# EAGLE design STorM32 NT BGC v332m sz2u (EAGLE 7.5.0)
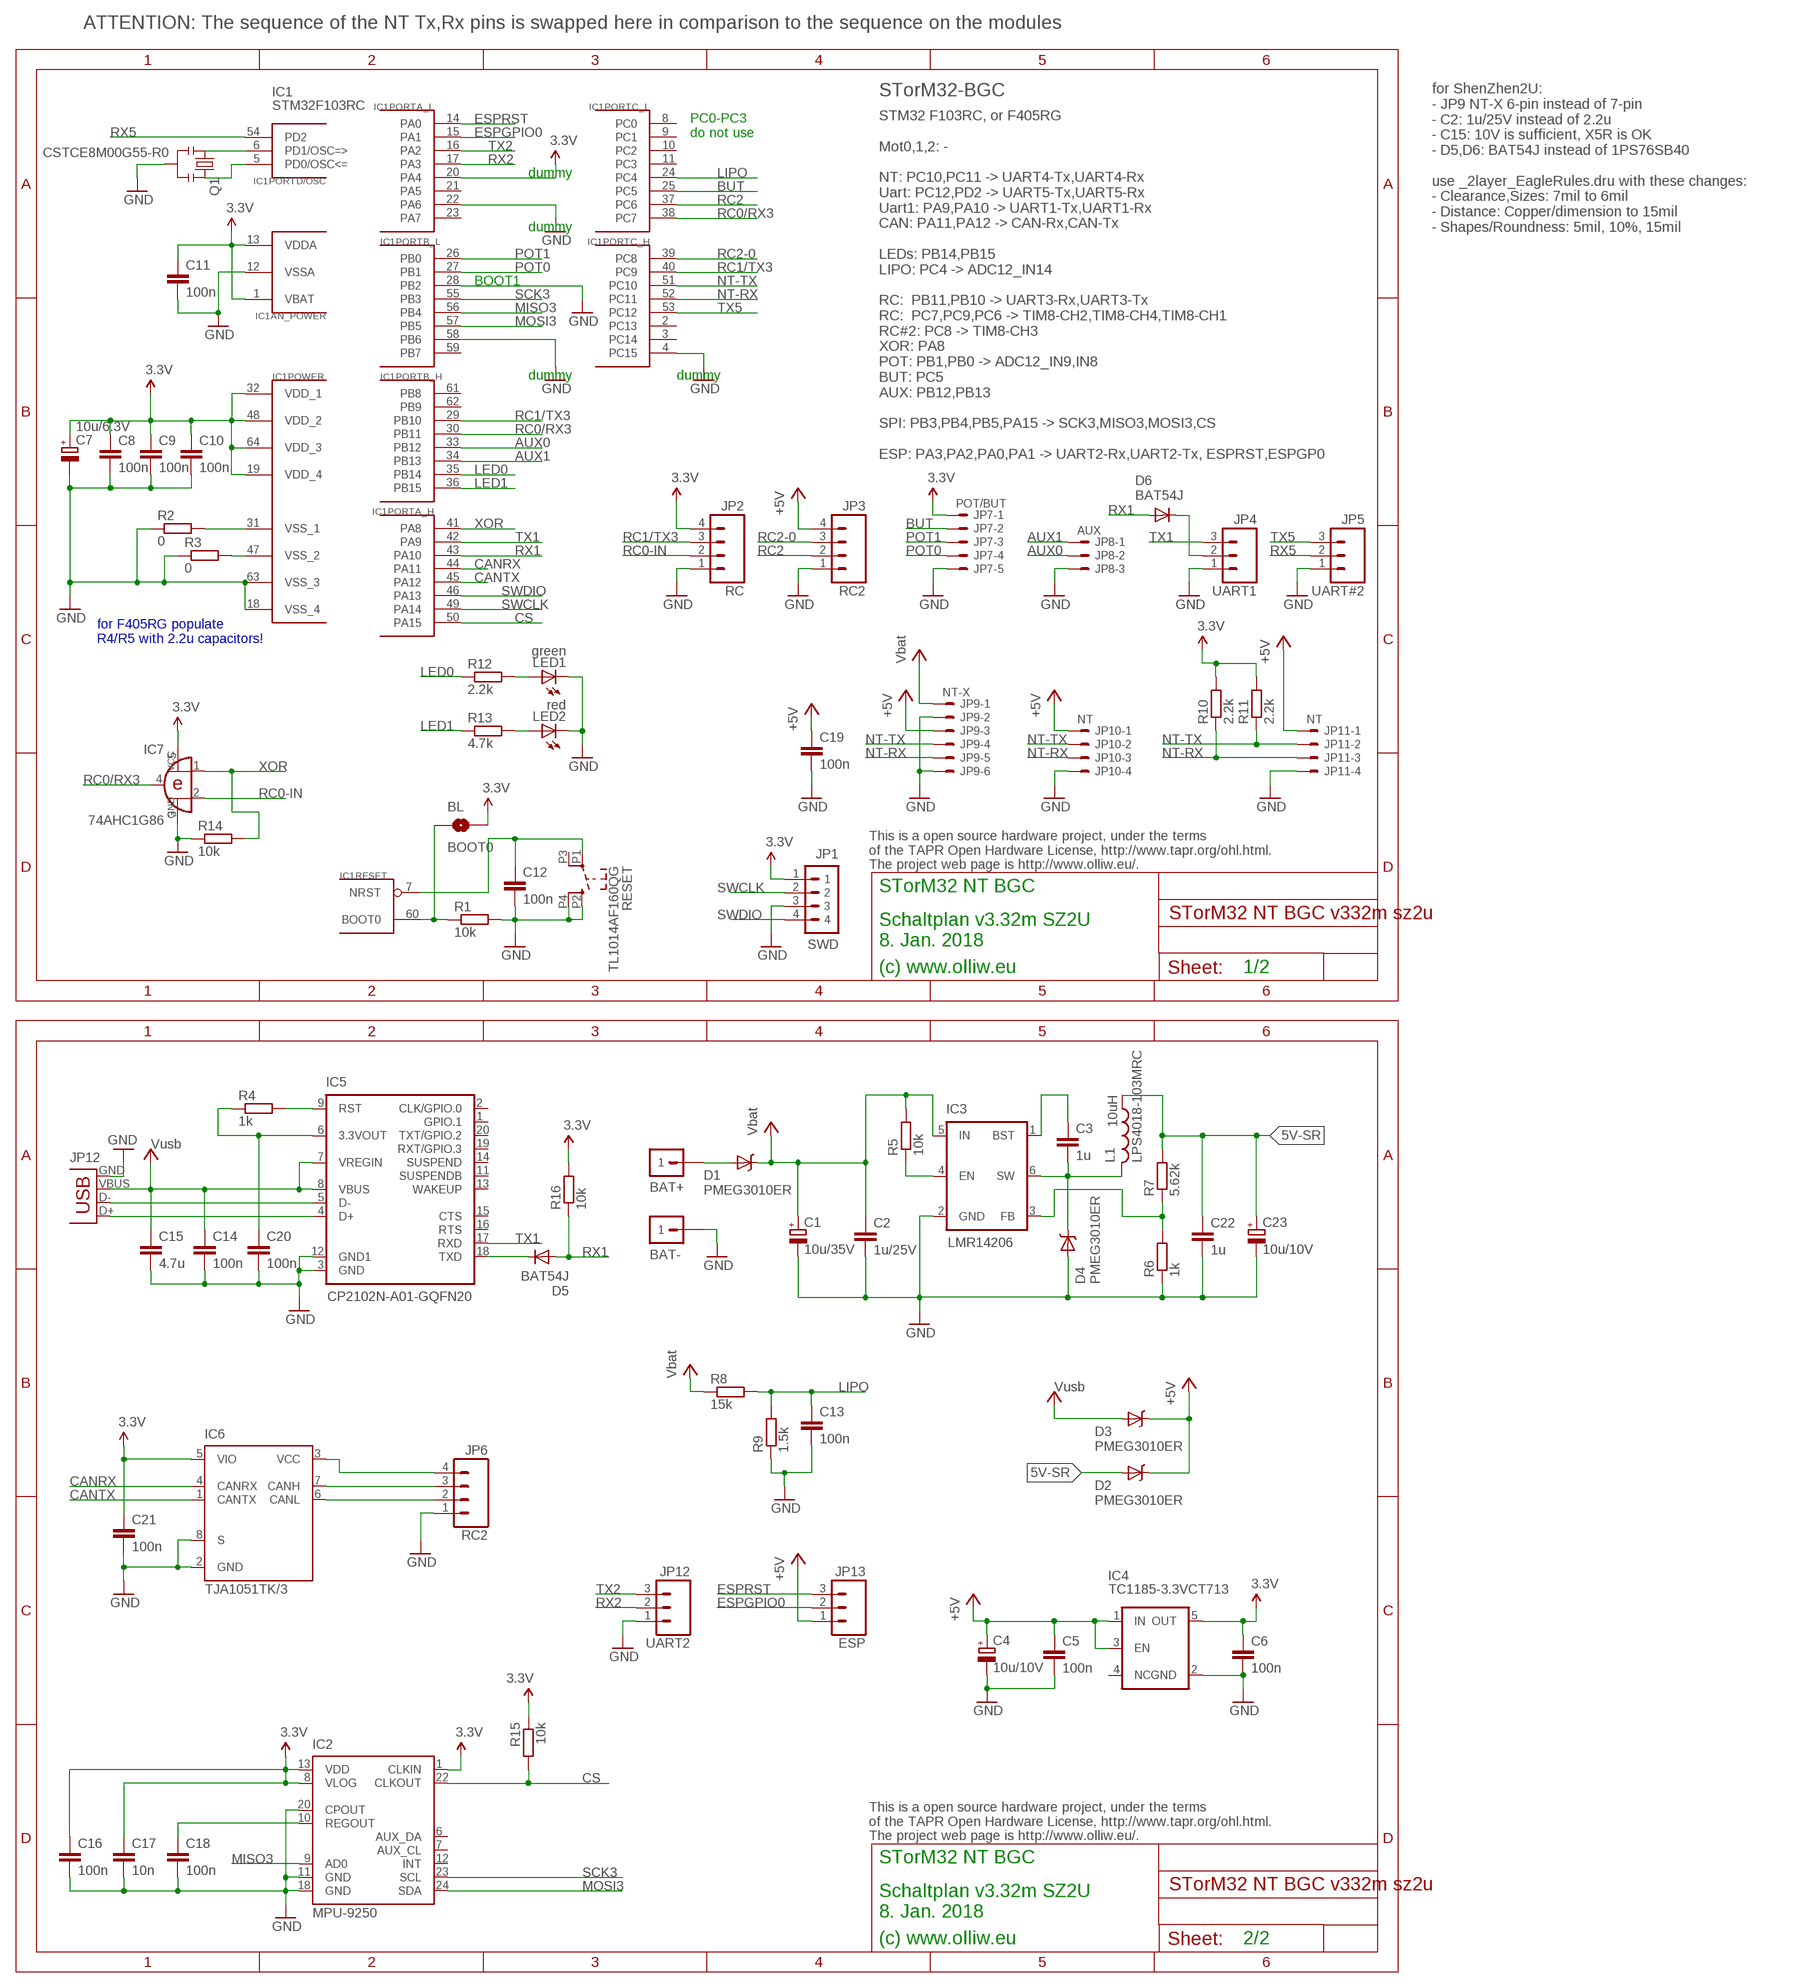
[diagram p0: schematic, sheet 1]

## Parts
BAT+  M1X1  [1X1_WITHOUT]
BAT-  M1X1  [1X1_WITHOUT]
BL  BOOT0  SOLDERJUMPERNO  [SJ_2S-NO]
C1  10u/35V  CPOL-EUSMCB  [SMC_B]
C2  1u/25V  C-EUC0603  [C0603]
C3  1u  C-EUC0603  [C0603]
C4  10u/10V  CPOL-EUSMCA  [SMC_A]
C5  100n  C-EUC0603  [C0603]
C6  100n  C-EUC0402  [C0402]
C7  10u/6.3V  CPOL-EUSMCA  [SMC_A]
C8  100n  C-EUC0402  [C0402]
C9  100n  C-EUC0402  [C0402]
C10  100n  C-EUC0402  [C0402]
C11  100n  C-EUC0402  [C0402]
C12  100n  C-EUC0402  [C0402]
C13  100n  C-EUC0402  [C0402]
C14  100n  C-EUC0402  [C0402]
C15  4.7u  C-EUC0603  [C0603]
C16  100n  C-EUC0402  [C0402]
C17  10n  C-EUC0402  [C0402]
C18  100n  C-EUC0402  [C0402]
C19  100n  C-EUC0402  [C0402]
C20  100n  C-EUC0402  [C0402]
C21  100n  C-EUC0402  [C0402]
C22  1u  C-EUC0603  [C0603]
C23  10u/10V  CPOL-EUSMCA  [SMC_A]
D1  PMEG3010ER  DIODE-SCHOTTKYSOD123-W  [SOD123W-DIODE]
D2  PMEG3010ER  DIODE-SCHOTTKYSOD123-W  [SOD123W-DIODE]
D3  PMEG3010ER  DIODE-SCHOTTKYSOD123-W  [SOD123W-DIODE]
D4  PMEG3010ER  DIODE-SCHOTTKYSOD123-W  [SOD123W-DIODE]
D5  BAT54J  DIODE-SOD110-R  [SOD110-R]
D6  BAT54J  DIODE-SOD110-R  [SOD110-R]
IC1  STM32F103RCT6  STM32F10XRXT6  [TQFP64]
IC2  MPU-9250  IMU3000QFN-24-0.4MIL  [QFN-24-3X3]
IC3  LMR14206  MP2359  [SOT23-6]
IC4  TC1185-3.3VCT713  V_REG_TPS76433SOT23-5  [SOT23-5]
IC5  CP2102N-A01-GQFN20  CP2102N-QFN20  [QFN20-CP2102N]
IC6  TJA1051TK/3  [HVSON8]
IC7  74AHC1G86  [SOT23-5-VER1]
JP1  SWD  P4X1_1P27-OCT_BILEX  [4X1_1P27_OCT_BILEX]
JP2  RC  M041X04_NO_SILK  [1X04_NO_SILK]
JP3  RC2  M041X04_NO_SILK  [1X04_NO_SILK]
JP4  UART1  M031X03_NO_SILK  [1X03_NO_SILK]
JP5  UART#2  M031X03_NO_SILK  [1X03_NO_SILK]
JP6  RC2  M041X04_NO_SILK  [1X04_NO_SILK]
JP7  POT/BUT  SM05B-SRSS-TB  [SM05B-SRSS-TB]
JP8  AUX  SM03B-SRSS-TB  [SM03B-SRSS-TB]
JP9  NT-X  SM06B-SRSS-TB  [SM06B-SRSS-TB]
JP10  NT  SM04B-SRSS-TB  [SM04B-SRSS-TB]
JP11  NT  SM04B-SRSS-TB  [SM04B-SRSS-TB]
JP12  UART2  M031X03_NO_SILK  [1X03_NO_SILK]
JP13  ESP  M031X03_NO_SILK  [1X03_NO_SILK]
L1  LPS4018-103MRC  L  [L4X4]
LED1  green  LEDCHIPLED_0603  [CHIPLED_0603]
LED2  red  LEDCHIPLED_0603  [CHIPLED_0603]
Q1  CSTCE8M00G55-R0  RESONATORSMD  [RESONATOR-SMD]
R1  10k  R-EU_R0402  [R0402]
R2  0  R-EU_R0402  [R0402]
R3  0  R-EU_R0402  [R0402]
R4  1k  R-EU_R0402  [R0402]
R5  10k  R-EU_R0402  [R0402]
R6  1k  R-EU_R0402  [R0402]
R7  5.62k  R-EU_R0402  [R0402]
R8  15k  R-EU_R0402  [R0402]
R9  1.5k  R-EU_R0402  [R0402]
R10  2.2k  R-EU_R0402  [R0402]
R11  2.2k  R-EU_R0402  [R0402]
R12  2.2k  R-EU_R0402  [R0402]
R13  4.7k  R-EU_R0402  [R0402]
R14  10k  R-EU_R0402  [R0402]
R15  10k  R-EU_R0402  [R0402]
R16  10k  R-EU_R0402  [R0402]
RESET  TL1014AF160QG  SWITCH-SMD-RIGHT-TL1014  [TACTILE-SWITCH-SMD-RIGHT-TL1014]
USB  Amphenol 10118192-0001LF  USB-MICROB  [USB-MICROB]

## Nets
3.3V: BL.2 C6.1 C7.+ C8.1 C9.1 C10.1 C11.1 C16.1 C17.1 C21.1 IC1.1(AN_POWER:VBAT) IC1.13(AN_POWER:VDDA) IC1.19(POWER:VDD_4) IC1.20(PORTA_L:PA4) IC1.32(POWER:VDD_1) IC1.48(POWER:VDD_2) IC1.64(POWER:VDD_3) IC2.1(CLKIN) IC2.8(VLOG) IC2.13(VDD) IC4.5(OUT) IC6.5(VIO) IC7.5(VCC) JP1.1 JP2.4 JP7.1 R10.2 R11.2 R15.1 R16.2
3.3V-CP2102: C20.1 IC5.6(3.3VOUT) R4.1
5V-CAN-RAW: IC6.3(VCC) JP6.4
5V-SR: C22.1 C23.+ D2.A L1.1 R7.2
+5V: C4.+ C5.1 C19.1 D2.C D3.C IC4.1(IN) IC4.3(EN) JP3.4 JP9.3 JP10.1 JP11.1 JP13.1
AUX0: IC1.33(PORTB_H:PB12) JP8.2
AUX1: IC1.34(PORTB_H:PB13) JP8.1
BATP: BAT+.1 D1.A
BOOT0: BL.1 IC1.60(RESET:BOOT0) R1.1
BUT: IC1.25(PORTC_L:PC5) JP7.2
CANH: IC6.7(CANH) JP6.3
CANL: IC6.6(CANL) JP6.2
CANRX: IC1.44(PORTA_H:PA11) IC6.4(CANRX)
CANTX: IC1.45(PORTA_H:PA12) IC6.1(CANTX)
CS: IC1.50(PORTA_H:PA15) IC2.22(CLKOUT) R15.2
ESPGPIO0: IC1.15(PORTA_L:PA1) JP13.2
ESPRST: IC1.14(PORTA_L:PA0) JP13.3
GND: BAT-.1 C1.- C2.2 C4.- C5.2 C6.2 C7.- C8.2 C9.2 C10.2 C11.2 C12.2 C13.2 C14.2 C15.2 C16.2 C17.2 C18.2 C19.2 C20.2 C21.2 C22.2 C23.- D4.A IC1.4(PORTC_H:PC15) IC1.12(AN_POWER:VSSA) IC1.18(POWER:VSS_4) IC1.22(PORTA_L:PA6) IC1.28(PORTB_L:PB2) IC1.58(PORTB_L:PB6) IC1.63(POWER:VSS_3) IC2.11(GND) IC2.18(GND) IC2.20(CPOUT) IC3.2(GND) IC4.2(GND) IC5.3(GND) IC5.12(GND1) IC6.2(GND) IC6.8(S) IC7.3(GND) JP1.3 JP2.1 JP3.1 JP4.1 JP5.1 JP6.1 JP7.5 JP8.3 JP9.2 JP9.6 JP10.4 JP11.4 JP12.1 LED1.C LED2.C Q1.2 R1.2 R2.1 R3.1 R6.1 R9.1 R14.1 RESET.P2 RESET.P4 USB.GND
LED0: IC1.35(PORTB_H:PB14) R12.1
LED1: IC1.36(PORTB_H:PB15) R13.1
LIPO: C13.1 IC1.24(PORTC_L:PC4) R8.2 R9.2
MISO3: IC1.56(PORTB_L:PB4) IC2.9(AD0)
MOSI3: IC1.57(PORTB_L:PB5) IC2.24(SDA)
N$5: IC5.5(D-) USB.D-
N$6: IC5.4(D+) USB.D+
N$7: IC3.4(EN) R5.1
N$8: LED1.A R12.2
N$9: LED2.A R13.2
N$10: IC1.47(POWER:VSS_2) R3.2
N$11: IC1.5(PORTD/OSC:PD0/OSC<=) Q1.3
N$12: IC1.6(PORTD/OSC:PD1/OSC=>) Q1.1
N$13: C3.1 IC3.1(BST)
N$14: IC3.3(FB) R6.2 R7.1
N$15: C3.2 D4.C IC3.6(SW) L1.2
N$16: D5.C IC5.18(TXD)
N$17: D6.C JP4.2
N$18: IC5.9(RST) R4.2
N$26: IC1.31(POWER:VSS_1) R2.2
NRST: C12.1 IC1.7(RESET:NRST) RESET.P1
NT-RX: IC1.52(PORTC_H:PC11) JP9.5 JP10.3 JP11.3 R10.1
NT-TX: IC1.51(PORTC_H:PC10) JP9.4 JP10.2 JP11.2 R11.1
POT0: IC1.27(PORTB_L:PB1) JP7.4
POT1: IC1.26(PORTB_L:PB0) JP7.3
RC0-IN: IC7.2(I1) JP2.2
RC0/RX3: IC1.30(PORTB_H:PB11) IC1.38(PORTC_L:PC7) IC7.4(O)
RC1/TX3: IC1.29(PORTB_H:PB10) IC1.40(PORTC_H:PC9) JP2.3
RC2: IC1.37(PORTC_L:PC6) JP3.2
RC2-0: IC1.39(PORTC_H:PC8) JP3.3
REGOUT: C18.1 IC2.10(REGOUT)
RX1: D5.A D6.A IC1.43(PORTA_H:PA10) R16.1
RX2: IC1.17(PORTA_L:PA3) JP12.2
RX5: IC1.54(PORTD/OSC:PD2) JP5.2
SCK3: IC1.55(PORTB_L:PB3) IC2.23(SCL)
SWCLK: IC1.49(PORTA_H:PA14) JP1.2
SWDIO: IC1.46(PORTA_H:PA13) JP1.4
TX1: IC1.42(PORTA_H:PA9) IC5.17(RXD) JP4.3
TX2: IC1.16(PORTA_L:PA2) JP12.3
TX5: IC1.53(PORTC_H:PC12) JP5.3
VCC: C1.+ C2.1 D1.C IC3.5(IN) JP9.1 R5.2 R8.1 ; supply symbol labelled Vbat
VUSB: C14.1 C15.1 D3.A IC5.7(VREGIN) IC5.8(VBUS) USB.VBUS ; supply symbol labelled Vusb
XOR: IC1.41(PORTA_H:PA8) IC7.1(I0) R14.2
Unconnected: IC1.2(PORTC_H:PC13) IC1.3(PORTC_H:PC14) IC1.8(PORTC_L:PC0) IC1.9(PORTC_L:PC1) IC1.10(PORTC_L:PC2) IC1.11(PORTC_L:PC3) IC1.21(PORTA_L:PA5) IC1.23(PORTA_L:PA7) IC1.59(PORTB_L:PB7) IC1.61(PORTB_H:PB8) IC1.62(PORTB_H:PB9) IC2.6(AUX_DA) IC2.7(AUX_CL) IC2.12(INT) IC4.4(NC) IC5.1(GPIO.1) IC5.2(CLK/GPIO.0) IC5.11(SUSPENDB) IC5.13(WAKEUP) IC5.14(SUSPEND) IC5.15(CTS) IC5.16(RTS) IC5.19(RXT/GPIO.3) IC5.20(TXT/GPIO.2) RESET.P3

## Notes on the sheet
- ATTENTION: The sequence of the NT Tx,Rx pins is swapped here in comparison to the sequence on the modules
- for ShenZhen2U:
  - JP9 NT-X 6-pin instead of 7-pin
  - C2: 1u/25V instead of 2.2u
  - C15: 10V is sufficient, X5R is OK
  - D5,D6: BAT54J instead of 1PS76SB40
  
  use _2layer_EagleRules.dru with these changes:
  - Clearance,Sizes: 7mil to 6mil
  - Distance: Copper/dimension to 15mil
  - Shapes/Roundness: 5mil, 10%, 15mil
- IC1 | STorM32-BGC
- STM32F103RC
- STM32 F103RC, or F405RG
  
  Mot0,1,2: -
  
  NT: PC10,PC11 -> UART4-Tx,UART4-Rx
  Uart: PC12,PD2 -> UART5-Tx,UART5-Rx
  Uart1: PA9,PA10 -> UART1-Tx,UART1-Rx
  CAN: PA11,PA12 -> CAN-Rx,CAN-Tx
  
  LEDs: PB14,PB15
  LIPO: PC4 -> ADC12_IN14
  
  RC:  PB11,PB10 -> UART3-Rx,UART3-Tx
  RC:  PC7,PC9,PC6 -> TIM8-CH2,TIM8-CH4,TIM8-CH1
  RC#2: PC8 -> TIM8-CH3
  XOR: PA8
  POT: PB1,PB0 -> ADC12_IN9,IN8
  BUT: PC5
  AUX: PB12,PB13
  
  SPI: PB3,PB4,PB5,PA15 -> SCK3,MISO3,MOSI3,CS
  
  ESP: PA3,PA2,PA0,PA1 -> UART2-Rx,UART2-Tx, ESPRST,ESPGP0
- PC0-PC3
  do not use
- dummy
- dummy
- BOOT1
- dummy | dummy
- for F405RG populate
  R4/R5 with 2.2u capacitors!
- This is a open source hardware project, under the terms
  of the TAPR Open Hardware License, http://www.tapr.org/ohl.html.
  The project web page is http://www.olliw.eu/.
- STorM32 NT BGC
- Schaltplan v3.32m SZ2U
  8. Jan. 2018
- (c) www.olliw.eu | 1/2
- 10uH
- JP12
- This is a open source hardware project, under the terms
  of the TAPR Open Hardware License, http://www.tapr.org/ohl.html.
  The project web page is http://www.olliw.eu/.
- STorM32 NT BGC
- Schaltplan v3.32m SZ2U
  8. Jan. 2018
- (c) www.olliw.eu | 2/2

## Library data of the parts
BAT+ BAT- = # stdlib:M1X1
BL = # SparkFun2:SOLDERJUMPER: Solder Jumper Standard SMD solder jumper. Used to automate production. Two varients : Normally Open and Normally Closed are the same, but have different paste layers. NC will have a large amount of paste and should jumper during reflow.
C1 C4 C7 C23 = rcl:CPOL-EU: POLARIZED CAPACITOR, European symbol
C2 C3 C5 C6 C8-C22 = rcl:C-EU: CAPACITOR, European symbol
D1-D4 = # stdlib:DIODE-SCHOTTKY
D5 D6 = diode:DIODE-: DIODE
IC1 = # stm32:STM32F10XRXT6: STM32F101/103 64pin LQFP
IC2 = # SparkFun2:IMU3000
IC3 = # stdlib:MP2359
IC4 = # SparkFun2:V_REG_TPS76433: Voltage Regulator Older TI part. LDO 150mA regulator. No output by-pass cap option. See V_REG_LDO for a better part.
IC5 = # stdlib:CP2102N-QFN20
IC6 = # stdlib:TJA1051TK/3
IC7 = # stdlib:74AHC1G86
JP1 = # stdlib:P4X1_1P27
JP2 JP3 JP6 = # SparkFun2:M04: Header 4 Standard 4-pin 0.1" header. Use with straight break away headers (SKU : PRT-00116), right angle break away headers (PRT-00553), swiss pins (PRT-00743), machine pins (PRT-00117), and female headers (PRT-00115). Molex polarized connector foot print use with SKU : PRT-08231 with associated crimp pins and housings. 1MM SMD Version SKU: PRT-10208
JP4 JP5 JP12 JP13 = # SparkFun2:M03: Header 3 Standard 3-pin 0.1" header. Use with straight break away headers (SKU : PRT-00116), right angle break away headers (PRT-00553), swiss pins (PRT-00743), machine pins (PRT-00117), and female headers (PRT-00115). Molex polarized connector foot print use with SKU : PRT-08232 with associated crimp pins and housings.
JP7 = con-jst2:?M05B-SRSS-TB: Disconnectable Crimp style connector, 1.0mm pitch 5 contacts
JP8 = con-jst2:?M03B-SRSS-TB: Disconnectable Crimp style connector, 1.0mm pitch 3 contacts
JP9 = con-jst2:?M06B-SRSS-TB: Disconnectable Crimp style connector, 1.0mm pitch 6 contacts
JP10 JP11 = con-jst2:?M04B-SRSS-TB: Disconnectable Crimp style connector, 1.0mm pitch 4 contacts
L1 = # stdlib:L
LED1 LED2 = led:LED: LED OSRAM: - CHIPLED LG R971, LG N971, LY N971, LG Q971, LY Q971, LO R971, LY R971 LH N974, LH R974 LS Q976, LO Q976, LY Q976 LO Q996 - Hyper CHIPLED LW Q18S LB Q993, LB Q99A, LB R99A - SideLED LS A670, LO A670, LY A670, LG A670, LP A670 LB A673, LV A673, LT A673, LW A673 LH A674 LY A675 LS A676, LA A676, LO A676, LY A676, LW A676 LS A679, LY A679, LG A679 - Hyper Micro SIDELED® LS Y876, LA Y876, LO Y876, LY Y876 LT Y87S - SmartLED LW L88C, LW L88S LB L89C, LB L89S, LG L890 LS L89K, LO L89K, LY L89K LS L896, LA L896, LO L896, LY L896 - TOPLED LS T670, LO T670, LY T670, LG T670, LP T670 LSG T670, LSP T670, LSY T670, LOP T670, LYG T670 LG T671, LOG T671, LSG T671 LB T673, LV T673, LT T673, LW T673 LH T674 LS T676, LA T676, LO T676, LY T676, LB T676, LH T676, LSB T676, LW T676 LB T67C, LV T67C, LT T67C, LS T67K, LO T67K, LY T67K, LW E67C LS E67B, LA E67B, LO E67B, LY E67B, LB E67C, LV E67C, LT E67C LW T67C LS T679, LY T679, LG T679 LS T770, LO T770, LY T770, LG T770, LP T770 LB T773, LV T773, LT T773, LW T773 LH T774 LS E675, LA E675, LY E675, LS T675 LS T776, LA T776, LO T776, LY T776, LB T776 LHGB T686 LT T68C, LB T68C - Hyper Mini TOPLED® LB M676 - Mini TOPLED Santana® LG M470 LS M47K, LO M47K, LY M47K Source: http://www.osram.convergy.de LUXEON: - LUMILED® LXK2-PW12-R00, LXK2-PW12-S00, LXK2-PW14-U00, LXK2-PW14-V00 LXK2-PM12-R00, LXK2-PM12-S00, LXK2-PM14-U00 LXK2-PE12-Q00, LXK2-PE12-R00, LXK2-PE12-S00, LXK2-PE14-T00, LXK2-PE14-U00 LXK2-PB12-K00, LXK2-PB12-L00, LXK2-PB12-M00, LXK2-PB14-N00, LXK2-PB14-P00, LXK2-PB14-Q00 LXK2-PR12-L00, LXK2-PR12-M00, LXK2-PR14-Q00, LXK2-PR14-R00 LXK2-PD12-Q00, LXK2-PD12-R00, LXK2-PD12-S00 LXK2-PH12-R00, LXK2-PH12-S00 LXK2-PL12-P00, LXK2-PL12-Q00, LXK2-PL12-R00 Source: www.luxeon.com KINGBRIGHT: KA-3528ASYC Source: www.kingbright.com
Q1 = # SparkFun2:RESONATOR: Resonator Small SMD resonator. This is the itty bitty 10/20MHz resonators with built in caps. CSTCE10M0G55 and CSTCE20M0V53. Footprint has been reviewed closely but hasn't been tested yet.
R1-R16 = rcl:R-EU_: RESISTOR, European symbol
RESET = # stdlib:SWITCH-SMD-RIGHT-TL1014
USB = # SparkFun2:USB: USB Connectors USB-B-PTH is fully proven SKU : PRT-00139 USB-miniB is fully proven SKU : PRT-00587 USB-A-PCB is untested. USB-A-H is throughly reviewed, but untested. Spark Fun Electronics SKU : PRT-00437 USB-B-SMT is throughly reviewed, but untested. Needs silkscreen touching up. USB-A-S has not been used/tested USB-MB-H has not been used/tested

## Board
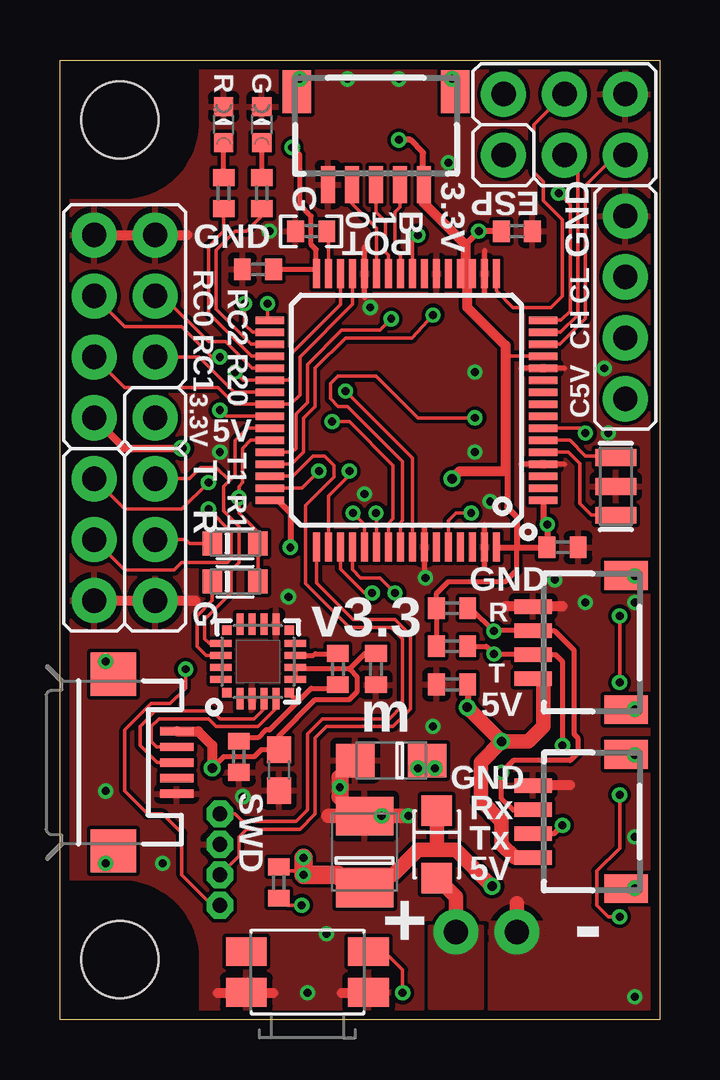
[diagram p1: board, top side]
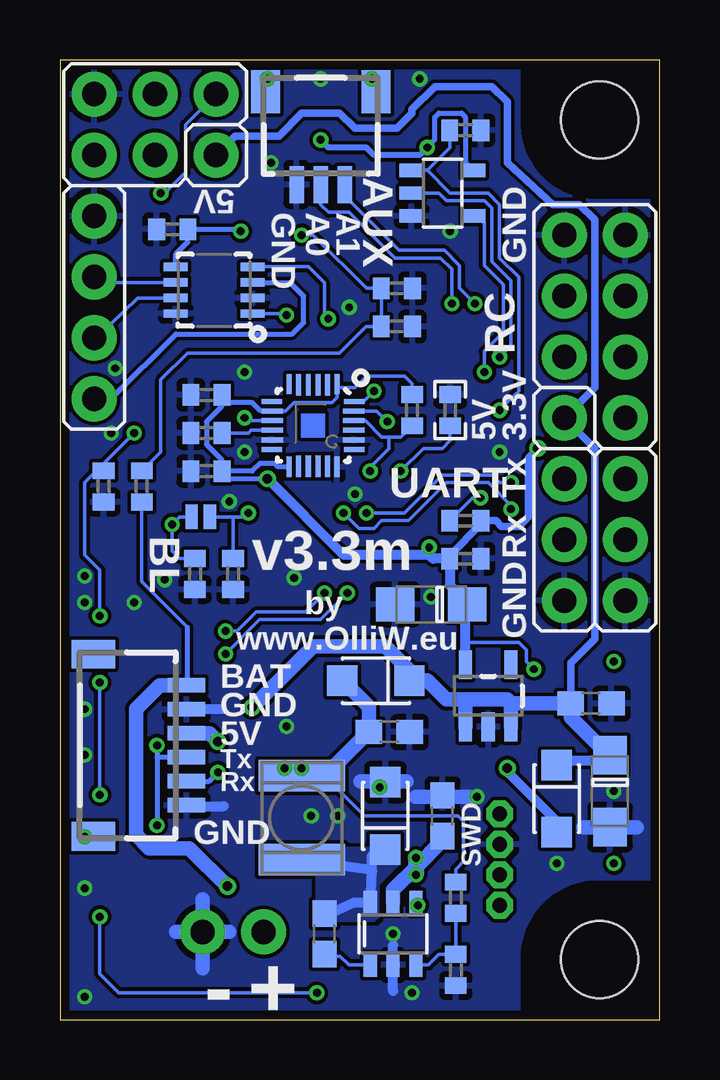
[diagram p2: board, bottom side, seen from below]

Size 25 x 40 mm. Coordinates in mm from the lower left corner, seen from the top.
Outline: 25,0 0,0 0,40 25,40 25,0
Copper layers (1*16): Top 0.035mm / dielectric 1.5mm / Bottom 0.035mm
Design rules "ShenZhen2U_2layer_EagleRules *": minimum track width 6mil, minimum drill 12mil, track to track 6mil, track to pad 6mil, pad to pad 6mil, via to via 6mil, smd to smd 0mil, copper to edge 15mil, drill to drill 10mil, minimum pad ring 10mil, minimum via ring 6mil, stop-mask expansion 2mil, vias tented up to drill 25mil, thermal gap 10mil
Holes 3.2 mm at 2.5,2.5 2.5,37.5

### Footprints (pad centres in the part's own frame; a part is rotated, then mirrored left to right if it is on the bottom)
1X1_WITHOUT = drill 1.016 pad 1.88: 1 0,0
SJ_2S-NO = smd 0.508 x 1.016: 1 -0.381,0; 2 0.381,0
SMC_B = smd 1.6 x 2.4: + -1.5,0; - 1.5,0
C0603 = smd 1.1 x 1: 1 -0.85,0; 2 0.85,0
SMC_A = smd 1.6 x 1.4: + -1.5,0; - 1.5,0
C0402 = smd 0.7 x 0.9: 1 -0.65,0; 2 0.65,0
SOD123W-DIODE = smd 1.27 x 1.27: A -1.4,0; C 1.4,0
SOD110-R = smd 0.8 x 1: A 0.95,0; C -0.95,0
TQFP64 = smd 1.2 x 0.3: 1 -5.7,3.75; 2 -5.7,3.25; 3 -5.7,2.75; 4 -5.7,2.25; 5 -5.7,1.75; 6 -5.7,1.25; 7 -5.7,0.75; 8 -5.7,0.25; 9 -5.7,-0.25; 10 -5.7,-0.75; 11 -5.7,-1.25; 12 -5.7,-1.75; 13 -5.7,-2.25; 14 -5.7,-2.75; 15 -5.7,-3.25; 16 -5.7,-3.75; 33 5.7,-3.75; 34 5.7,-3.25; 35 5.7,-2.75; 36 5.7,-2.25; 37 5.7,-1.75; 38 5.7,-1.25; 39 5.7,-0.75; 40 5.7,-0.25; 41 5.7,0.25; 42 5.7,0.75; 43 5.7,1.25; 44 5.7,1.75; 45 5.7,2.25; 46 5.7,2.75; 47 5.7,3.25; 48 5.7,3.75 | smd 0.3 x 1.2: 17 -3.75,-5.7; 18 -3.25,-5.7; 19 -2.75,-5.7; 20 -2.25,-5.7; 21 -1.75,-5.7; 22 -1.25,-5.7; 23 -0.75,-5.7; 24 -0.25,-5.7; 25 0.25,-5.7; 26 0.75,-5.7; 27 1.25,-5.7; 28 1.75,-5.7; 29 2.25,-5.7; 30 2.75,-5.7; 31 3.25,-5.7; 32 3.75,-5.7; 49 3.75,5.7; 50 3.25,5.7; 51 2.75,5.7; 52 2.25,5.7; 53 1.75,5.7; 54 1.25,5.7; 55 0.75,5.7; 56 0.25,5.7; 57 -0.25,5.7; 58 -0.75,5.7; 59 -1.25,5.7; 60 -1.75,5.7; 61 -2.25,5.7; 62 -2.75,5.7; 63 -3.25,5.7; 64 -3.75,5.7
QFN-24-3X3 = smd 0.85 x 0.21: 1 -1.725,1; 6 -1.725,-1; 13 1.725,-1; 18 1.725,1 | smd 0.9 x 0.21: 2 -1.7,0.6; 3 -1.7,0.2; 5 -1.7,-0.6; 14 1.7,-0.6; 15 1.7,-0.2; 16 1.7,0.2; 17 1.7,0.6 | smd 0.9 x 0.2: 4 -1.7,-0.2 | smd 0.21 x 0.85: 7 -1,-1.725; 12 1,-1.725; 19 1,1.725; 24 -1,1.725 | smd 0.21 x 0.9: 8 -0.6,-1.7; 9 -0.2,-1.7; 10 0.2,-1.7; 11 0.6,-1.7; 20 0.6,1.7; 21 0.2,1.7; 22 -0.2,1.7; 23 -0.6,1.7
SOT23-6 = smd 0.55 x 0.99: 1 -0.95,-1.3; 2 0,-1.3; 3 0.95,-1.3; 4 0.95,1.3; 5 0,1.3; 6 -0.95,1.3
SOT23-5 = smd 0.55 x 1.2: 1 -0.95,-1.3; 2 0,-1.3; 3 0.95,-1.3; 4 0.95,1.3; 5 -0.95,1.3
QFN20-CP2102N = smd 0.4 x 0.4: 1 -1.3,1.3; 6 -1.3,-1.3; 11 1.3,-1.3; 16 1.3,1.3 | smd 0.9 x 0.3: 2 -1.55,0.75; 3 -1.55,0.25; 4 -1.55,-0.25; 5 -1.55,-0.75; 12 1.55,-0.75; 13 1.55,-0.25; 14 1.55,0.25; 15 1.55,0.75 | smd 0.3 x 0.9: 7 -0.75,-1.55; 8 -0.25,-1.55; 9 0.25,-1.55; 10 0.75,-1.55; 17 0.75,1.55; 18 0.25,1.55; 19 -0.25,1.55; 20 -0.75,1.55
HVSON8 = smd 1 x 0.35: 1 -1.6,0.975; 2 -1.6,0.325; 3 -1.6,-0.325; 4 -1.6,-0.975; 5 1.6,-0.975; 6 1.6,-0.325; 7 1.6,0.325; 8 1.6,0.975
SOT23-5-VER1 = smd 0.55 x 0.99: 1 -0.95,-1.29; 2 0,-1.29; 3 0.95,-1.29; 4 0.95,1.3; 5 -0.95,1.3
4X1_1P27_OCT_BILEX = drill 0.61 pad 1.118 octagon: 1 0,0; 2 0,-1.27; 3 0,-2.54; 4 0,-3.81
1X04_NO_SILK = drill 1.016 pad 1.88: 1 0,0; 2 2.54,0; 3 5.08,0; 4 7.62,0
1X03_NO_SILK = drill 1.016 pad 1.88: 1 0,0; 2 2.54,0; 3 5.08,0
SM05B-SRSS-TB = smd 0.6 x 1.55: 1 -2,2.975; 2 -1,2.975; 3 0,2.975; 4 1,2.975; 5 2,2.975 | smd 1.2 x 1.8: FIT@1 -3.3,-0.9; FIT@2 3.3,-0.9
SM03B-SRSS-TB = smd 0.6 x 1.55: 1 -1,2.975; 2 0,2.975; 3 1,2.975 | smd 1.2 x 1.8: FIT@1 -2.3,-0.9; FIT@2 2.3,-0.9
SM06B-SRSS-TB = smd 0.6 x 1.55: 1 -2.5,2.975; 2 -1.5,2.975; 3 -0.5,2.975; 4 0.5,2.975; 5 1.5,2.975; 6 2.5,2.975 | smd 1.2 x 1.8: FIT@1 -3.8,-0.9; FIT@2 3.8,-0.9
SM04B-SRSS-TB = smd 0.6 x 1.55: 1 -1.5,2.975; 2 -0.5,2.975; 3 0.5,2.975; 4 1.5,2.975 | smd 1.2 x 1.8: FIT@1 -2.8,-0.9; FIT@2 2.8,-0.9
L4X4 = smd 1.3 x 3.6: 1 -1.75,0; 2 1.75,0
CHIPLED_0603 = smd 0.8 x 0.8: A 0,-0.75; C 0,0.75
RESONATOR-SMD = smd 0.7 x 1.7: 1 -1.2,0; 2 0,0; 3 1.2,0
R0402 = smd 0.7 x 0.9: 1 -0.65,0; 2 0.65,0
TACTILE-SWITCH-SMD-RIGHT-TL1014 = smd 1.7 x 1.2: P1 2.55,0.85; P2 2.55,-0.85; P3 -2.55,0.85; P4 -2.55,-0.85
USB-MICROB = smd 0.35 x 1.4: D+ 0,2.65; D- -0.65,2.65; GND 1.3,2.65; ID 0.65,2.65; VBUS -1.3,2.65 | smd 1.8 x 1.9: MT1 -3.683,0; MT2 3.683,0

### Placement (x,y rotation side)
BAT+  16.51,3.65 90 top
BAT-  19.05,3.65 0 top
BL  19.13,20.95 180 bottom
C1  12.7,6.99 90 top
C2  9.05,8.49 90 bottom
C3  13.97,3.57 90 bottom
C4  2.06,9.53 270 bottom
C5  2.86,13.18 0 bottom
C6  8.1,19.21 0 bottom
C7  9.53,17.3 180 bottom
C8  20.95,19.68 0 top
C9  8.26,31.27 180 top
C10  19.37,18.57 270 bottom
C11  19.05,32.86 0 top
C12  23.18,22.23 270 bottom
C13  10.95,28.89 0 bottom
C14  13.18,14.61 270 top
C15  9.13,10.4 270 top
C16  18.89,22.86 180 bottom
C17  18.89,26.04 180 bottom
C18  18.89,24.45 180 bottom
C19  16.35,13.97 180 top
C20  7.46,10.95 270 top
C21  20.32,32.94 180 bottom
C22  11.27,11.99 0 bottom
C23  13.81,10.79 180 top
D1  15.72,7.3 90 top
D2  11.83,14.13 0 bottom
D3  4.29,9.21 90 bottom
D4  11.43,8.49 270 bottom
D5  7.3,18.26 0 top
D6  7.3,19.84 0 top
IC1  14.45,25.4 180 top
IC2  14.45,24.77 270 bottom
IC3  11.11,3.57 0 bottom
IC4  7.14,13.49 0 bottom
IC5  8.26,14.92 90 top
IC6  18.57,30.4 180 bottom
IC7  9.05,34.45 270 bottom
JP1  6.67,4.76 180 top
JP2  1.43,32.7 270 top
JP3  3.97,32.7 270 top
JP4  3.97,17.46 90 top
JP5  1.43,17.46 90 top
JP6  23.57,33.5 270 top
JP7  13.18,37.78 180 top
JP8  14.13,37.78 180 bottom
JP9  22.7,11.43 270 bottom
JP10  22.7,15.72 90 top
JP11  22.7,8.26 90 top
JP12  23.57,38.58 180 top
JP13  18.49,36.04 0 top
L1  14.92,8.41 270 bottom
LED1  8.41,37.31 0 top
LED2  6.83,37.31 0 top
Q1  23.18,22.23 270 top
R1  17.78,18.57 270 bottom
R2  10.48,32.86 0 top
R3  8.73,25.4 270 bottom
R4  11.59,14.61 90 top
R5  9.13,5.71 90 top
R6  8.49,2.06 90 bottom
R7  8.49,5.08 90 bottom
R8  21.59,22.23 90 bottom
R9  10.95,30.48 180 bottom
R10  16.35,17.14 180 top
R11  16.35,15.56 180 top
R12  8.41,34.45 90 top
R13  6.83,34.45 90 top
R14  8.1,37.07 180 bottom
R15  10.32,25.4 270 bottom
R16  8.1,20.8 0 bottom
RESET  10.32,1.98 0 top
USB  2.22,10.72 270 top

### Tracks (layer width: path | path; a pad name or v marks a point on that pad's centre or on a via)
3.3V  (via drill 0.33, 0.4)
  Top 0.152: 10.68,31.27 IC1.32 | 15.15,34.87 JP7.1 | 20.34,19.74 C8.1 | IC1.20 16.89,31.1 | 16.89,31.1 IC1.19 16.99,30.89 | 16.89,31.1 16.91,31.27 | JP1.1 6.35,4.76 5.08,6.03 5.08,7.78 4.29,8.57 3.65,8.57 2.7,9.53 2.7,12.06 3.81,13.18 4.6,13.18 5.24,13.81 v5.24,14.61 | IC1.13 18.6,27.65 18.57,28.1 | IC1.64 18.21,19.68
  Top 0.203: R11.2 R10.2 15.7,17.77 16.19,18.26 18.57,18.26 19.05,18.73 19.05,19.68 | 10.68,31.27 10.68,32.1 10.48,32.31 10.48,33.5 10,33.97 10,36.04 v9.68,36.35 | C9.1 10.7,31.27 IC1.32
  Top 0.254: 15.15,34.87 15.15,36.13 14.6,36.67 v14.13,36.67 | 18.57,22.86 18.65,22.86 18.65,21.35 19.05,20.95 19.05,19.68 | 16.91,32.31 v17.46,32.86 18.41,32.86 18.4,32.88 C11.1 | 18.21,19.68 19.05,19.68 | 19.05,19.68 C8.1 | IC1.1 20.15,20.81 v20.32,20.64 20.34,20.5 20.34,19.74 | IC1.48 9.06,21.65 9.6,21.11 v9.6,19.68
  Top 0.305: JP2.4 2.7,23.81 v5.08,23.81
  Top 0.406: JP7.1 15.18,34.04 16.91,32.31 16.91,31.27 | v16.35,22.54 16.67,22.86 18.57,22.86 18.57,28.1 16.99,29.69 16.99,30.89
  Bottom 0.152: 8.1,15.11 IC4.5 | v5.24,14.61 5.56,14.92 5.56,15.4 5.87,15.72 8.09,15.72 | 7.78,35.4 IC7.5 | C10.1 19.38,19.21 20,19.21 20.32,19.53 v20.32,20.64 20,20.95 BL.2 | R15.1 10.32,26.51 10.64,26.83 12.22,26.83 12.7,26.35 13.45,26.35 IC2.1 13.45,25.92 13.65,25.72 15.24,25.72 15.59,25.36 IC2.8 | 18.26,22.88 C16.1 18.26,22.86 17.94,22.54
  Bottom 0.203: v9.68,36.35 9.37,36.67 9.37,37.62 9.21,37.78 8.26,37.78 8.1,37.62 8.1,35.72 7.78,35.4 | v17.46,32.86 17.54,32.94 C21.1 19.67,32.4 20.17,31.9 IC6.5 | IC2.8 16.63,25.36 16.99,25.72 17.92,25.72 C17.1 18.24,25.57 18.89,24.92 18.89,23.97 18.26,23.34 18.26,22.88 | 17.94,22.54 v16.35,22.54 | IC2.13 15.9,23.04 16.03,23.18 16.65,23.18 16.99,22.86 C16.1
  Bottom 0.254: v9.68,36.35 10,36.04 11.91,36.04 12.22,36.35 13.81,36.35 v14.13,36.67
  Bottom 0.305: R16.2 6.83,20.8 6.59,20.56 5.87,20.56 5.48,20.95 5.48,23.42 v5.08,23.81 | 7.45,20.65 8.75,19.35
  Bottom 0.406: 9.6,19.37 13.18,19.37 v16.35,22.54 | IC4.5 8.09,15.72 8.09,17.37 | 8.09,17.37 C7.+ | R16.2 7.45,20.65 | 8.75,19.35 C6.1 | 8.09,17.37 8.09,17.46 8.75,18.11 C6.1 | C6.1 9.45,19.21 9.6,19.37 | 9.6,19.37 v9.6,19.68
3.3V-CP2102
  Top 0.203: 9.92,13.26 8.73,12.06 8.57,12.06 8.26,11.75 7.61,11.75 C20.1 | 11.57,13.96 R4.1 11.44,13.81 10.48,13.81 9.92,13.26 | IC5.6 9.92,13.26
5V-CAN-RAW
  Bottom 0.203: IC6.3 15.41,30.73 14.84,30.16 14.84,29.05 15.32,28.57 20.16,28.57 22.86,25.88 JP6.4
5V-SR  (via drill 0.33)
  Top 0.406: 15.08,10.79 v14.92,10.48 v15.64,10.48
  Top 0.61: C23.+ 15.08,10.79
  Bottom 0.152: L1.1 13.91,10.1 12.3,8.49 8.41,8.49 8.18,8.26 8.18,6.59 8.49,6.27 R7.2
  Bottom 0.61: 15.56,10.48 v14.92,10.48 L1.1 14.7,10.48 13.65,10.48 12.14,11.99 C22.1 12.12,13.02 D2.A
+5V  (via drill 0.4)
  Top 0.152: 19.71,6.76 JP11.1
  Top 0.254: C19.1 17,13.19 v16.99,13.02
  Top 0.406: JP10.1 20.07,14.22 20.16,14.13
  Top 0.61: v18.41,11.59 19.53,11.59 20.16,12.22 20.16,14.13 | v18.41,11.59 17.54,10.72 17.54,9.13 18.41,8.26 18.41,7.3 18.96,6.76 19.71,6.76 | v16.99,13.02 v18.41,11.59
  Bottom 0.305: C5.1 3.71,14.87 2.7,15.88 2.7,23.81 JP3.4 2.7,26.35 2.7,33.34 3.33,33.97 4.45,33.97 6.35,35.72 6.35,38.26 6.98,38.89 9.37,38.89 10.32,37.94 10.32,37.78 10.95,37.15 12.7,37.15 13.33,37.78 14.92,37.78 15.87,36.83 17.7,36.83 JP13.1
  Bottom 0.406: D3.C 4.29,10.79 2.29,10.79 C4.+
  Bottom 0.61: 8.1,13.34 6.35,13.34 6.19,13.18 | 8.1,13.34 8.89,13.34 9.68,14.13 D2.C 10.43,14.55 11.43,15.56 14.45,15.56 v16.99,13.02 | IC4.1 8.1,12.51 8.1,13.34 | C5.1 3.65,13.12 | 6.19,13.18 C5.1 | 6.19,13.18 6.19,12.51 IC4.3 | C4.+ 2.22,11.11 3.71,12.6 C5.1 | JP9.3 18.76,11.93 v18.41,11.59
AUX0  (via drill 0.33)
  Top 0.152: IC1.33 8.65,29.16 v8.65,29.84
  Bottom 0.152: v8.65,29.84 8.65,31.27 9.13,31.75 11.03,31.75 12.94,33.66 13.81,33.66 14.13,33.97 JP8.2
AUX1  (via drill 0.33)
  Top 0.152: IC1.34 8.02,28.65 7.7,28.97 v7.7,29.84
  Bottom 0.152: v7.7,29.84 8.33,30.48 8.33,31.43 8.97,32.07 10.87,32.07 12.89,34.08 JP8.1
BATP
  Top 0.61: BAT+.1 16.51,5.11 D1.A
  pour Top (no thermals): 15.4,3.89 15.4,0.48 17.62,0.48 17.62,3.89
BOOT0  (via drill 0.33)
  Top 0.152: IC1.60 16.2,20.8 16.51,21.11 v17.15,21.11
  Bottom 0.152: BL.1 17.78,20.95 | 17.78,20.95 17.3,20.95 v17.15,21.11 | R1.1 17.78,20.95
BUT
  Top 0.152: IC1.25 14.2,31.84 13.97,32.07 13.97,33.66 14.18,33.86 JP7.2
CANH
  Bottom 0.152: IC6.7 21.76,30.08 23.49,28.42 JP6.3
CANL
  Bottom 0.152: IC6.6 23.33,30.73 JP6.2
CANRX  (via drill 0.33)
  Top 0.152: IC1.44 9.68,23.65 9.84,23.81 9.84,25.24 10.32,25.72 10.32,27.3 11.75,28.73 13.33,28.73 v13.81,29.21
  Bottom 0.152: IC6.4 14.63,31.38 13.97,30.72 13.97,29.37 v13.81,29.21
CANTX  (via drill 0.33)
  Top 0.152: IC1.45 9.66,23.15 10.16,23.65 10.16,25.08 10.64,25.56 10.64,27.15 11.91,28.42 14.68,28.42 v15.56,29.37
  Bottom 0.152: IC6.1 15.61,29.43 v15.56,29.37
CS  (via drill 0.33)
  Top 0.152: IC1.50 11.2,21.83 12.06,22.7 v12.06,22.86
  Bottom 0.152: IC2.22 12.26,24.96 11.59,24.29 11.27,24.29 | 11.27,24.29 10.78,24.29 R15.2 | v12.06,22.86 12.06,23.02 11.27,23.81 11.27,24.29
ESPGPIO0
  Top 0.152: IC1.15 20.87,28.65 21.59,29.37 21.59,35.48 JP13.2
ESPRST
  Top 0.152: IC1.14 20.85,28.15 21.91,29.21 21.91,34.77 23.18,36.04 JP13.3
GND  (via drill 0.33)
  Top 0.152: IC1.63 17.7,18.89
  Top 0.203: 17.7,32.07 17.7,30.16 | 12.7,30.08 12.7,32.23 | 21.03,27.15 19.21,27.15 | 17.7,20.64 17.7,18.89 17.7,18.81 | 21.03,23.15 19.21,23.15 | 15.2,20.63 15.2,18.73
  Top 0.254: 11.67,10.08 11.67,10.15 C23.-
  Top 0.406: 11.75,1.11 12.78,1.11 | JP2.1 5.32,32.7 | 6.59,1.11 8.89,1.11 | 20.95,17.22 18.57,17.22 | 21.27,9.76 19.37,9.76 | JP5.1 5.64,17.46
  Top 0.61: BAT-.1 19.05,4.84 | 14.29,8.49 11.19,8.49
  Top 0.711: 11.67,10.08 11.67,9.29
  Bottom 0.406: 11.11,1.19 11.11,3.1 | 20.16,12.94 18.26,12.94 | 20.32,8.89 18.18,8.89
  Bottom 0.61: 19.05,5 19.05,2.14 | 17.94,3.65 20.16,3.65 | 10.56,9.92 12.46,9.92 | 7.94,9.29 10.16,9.29 | 0.95,8.02 3.18,8.02
  other vias: 14.13,39.21 23.97,0.95 10.32,1.11 23.97,7.62 23.97,5.48 23.97,11.03 23.97,12.94 23.97,18.49 11.99,39.21 23.97,17.38 10,39.21 15.24,18.41 9.53,17.62 14.53,8.49 11.11,3.57 4.29,6.51 1.91,9.53 21.91,17.38 7.62,9.29 15.56,12.22 11.67,9.68 13.41,8.49 6.67,23.65 12.94,29.69 8.73,32.86 16.19,35.72 20.64,18.34 22.7,27.15 22.86,24.45 17.3,26.99 17.3,23.65 12.7,21.91 17.94,21.59
  pour Top (isolate 0.152, rank 6): 5.87,-0.16 5.87,2.54 arc90 2.54,5.87 -0.63,5.87 -0.63,34.13 2.54,34.13 arc90 5.87,37.31 5.87,40.32 25.23,40.32 25.23,-0.16
  pour Bottom (isolate 0.152, rank 6): 5.87,-0.16 5.87,2.54 arc90 2.54,5.87 -0.63,5.87 -0.63,34.13 2.54,34.13 arc90 5.87,37.31 5.87,40.32 25.23,40.32 25.23,-0.16
  pour Top (no thermals): 20.16,4.05 20.16,0.48 17.94,0.48 17.94,4.05
LED0
  Top 0.152: R12.1 8.41,33.5 7.78,32.86 7.3,32.86 6.51,32.07 6.51,29.61 7.97,28.15 IC1.35
LED1
  Top 0.152: R13.1 6.83,32.86 6.19,32.23 6.19,29.45 7.99,27.65 IC1.36
LIPO  (via drill 0.33)
  Top 0.152: IC1.24 14.7,32.48 v14.92,32.7
  Bottom 0.152: v14.92,32.7 14.45,32.7 12.22,30.48 R9.2 C13.1 12.24,28.88 13.33,27.78 19.69,27.78 20.8,26.67 20.8,23.65 21.59,22.86 R8.2 21.59,23.02
MISO3  (via drill 0.33)
  Top 0.152: IC1.56 14.2,20.7 14.29,20.8 14.29,23.26 11.99,25.56 11.59,25.56 11.27,25.88 11.27,26.51 11.59,26.83 13.18,26.83 14.92,25.08 v17.3,25.08
  Bottom 0.152: IC2.9 17.19,24.96 v17.3,25.08
MOSI3  (via drill 0.33)
  Top 0.152: IC1.57 14.7,23.4 v11.91,26.19
  Bottom 0.152: IC2.24 12.33,25.77 v11.91,26.19
N$1  (via drill 0.33)
  other vias: 1.91,14.92
N$2  (via drill 0.33)
  other vias: 1.91,6.51
N$4  (via drill 0.33)
  other vias: 16.35,39.21
N$5
  Top 0.152: USB.D- 4.03,11.37 3.81,11.59 3.81,12.22 4.13,12.54 6.19,12.54 6.51,12.22 8.26,12.22 9.01,12.97 IC5.5
N$6
  Top 0.152: USB.D+ 4.05,10.72 3.33,11.43 3.33,12.22 3.97,12.86 6.35,12.86 6.67,12.54 8.1,12.54 8.51,12.95 IC5.4
N$7  (via drill 0.33)
  Top 0.152: v10.08,4.76 9.51,4.76 9.37,4.92 9.05,4.91 R5.1
  Bottom 0.152: v10.08,4.76 10.08,4.84 IC3.4
N$8
  Top 0.152: 8.43,36.85 LED1.A | 8.43,35.28 R12.2
  Top 0.203: 8.43,35.28 8.43,36.85
N$9
  Top 0.203: R13.2 LED2.A
N$10  (via drill 0.33)
  Top 0.152: IC1.47 10.08,22.15 v10.79,22.86
  Bottom 0.152: R3.2 8.73,24.13 9.05,23.81 9.84,23.81 v10.79,22.86
N$11
  Top 0.152: IC1.5 21.2,23.65 21.67,23.18 21.67,21.51 22.16,21.02 Q1.3
N$12
  Top 0.152: IC1.6 21.25,24.15 21.91,23.5 23.11,23.5 Q1.1
N$13
  Bottom 0.152: IC3.1 12.95,2.27 13.32,2.64 13.97,2.64 C3.1
N$14
  Bottom 0.152: R7.1 R6.2 9.19,2.71 9.63,2.27 IC3.3
N$15
  Bottom 0.406: 11.98,6.19 IC3.6 12.75,4.87 13.65,4.45 | 11.98,6.19 11.98,6.86 D4.C | L1.2 12.08,6.25 11.98,6.19
  pour Bottom (no thermals): 10.87,6.51 11.75,5.64 11.75,4.29 11.91,4.13 14.13,4.13 14.29,4.29 14.29,6.83 14.13,7.14 10.87,7.14
N$16
  Top 0.152: IC5.18 6.1,15.17 5.71,15.56 5.71,16.83 6.35,17.46 D5.C
N$17
  Top 0.152: JP4.2 5.24,20 5.4,19.84 D6.C
N$18
  Top 0.203: IC5.9 10.54,15.17 10.64,15.24 11.42,15.24 R4.2
N$26
  Top 0.152: IC1.31 11.2,32.32 R2.2
NRST  (via drill 0.33)
  Top 0.152: 12.88,2.9 RESET.P1 13.52,2.83 14.29,2.06 v14.29,1.11 | v23.34,16.83 v23.34,14.05 | v23.34,9.37 23.34,7.14 22.38,6.19 22.38,4.76 22.86,4.29 v23.34,4.29 | IC1.7 21.7,24.65 v21.91,24.45
  Bottom 0.152: v14.29,1.11 22.54,1.11 23.34,1.91 v23.34,4.29 | v23.34,9.37 v23.34,14.05 | v23.34,16.83 23.34,18.73 23.97,19.37 23.97,22.38 23.49,22.86 23.19,22.86 C12.1 23.18,23.18 v21.91,24.45
NT-RX  (via drill 0.33)
  Top 0.152: JP11.3 19.75,8.73 | IC1.52 12.2,18.76 12.54,18.41 13.33,18.41 v13.97,17.78
  Top 0.203: R10.1 17.15,17.14 v18.1,16.19 18.12,16.22 JP10.3 20.61,16.22 21.43,15.4 21.43,11.91 21.59,11.75 21.59,11.11 21.27,10.79 18.9,10.79 v18.41,10.31 18.41,9.21 18.89,8.73 19.75,8.73
  Bottom 0.152: v13.97,17.78 14.76,16.99 16.83,16.99 17.62,16.19 v18.1,16.19
  Bottom 0.203: JP9.5 18.79,9.93 v18.41,10.31
NT-TX  (via drill 0.33)
  Top 0.152: IC1.51 11.7,18.78 12.7,17.78 v13.02,17.78
  Top 0.203: R11.1 17.78,15.56 v18.1,15.24 18.15,15.22 JP10.2 20.66,15.22 20.95,14.92 v20.95,11.43 | JP11.2 20.61,7.75 v20.95,8.1
  Bottom 0.152: v13.02,17.78 14.13,16.67 16.67,16.67 v18.1,15.24
  Bottom 0.203: v20.95,11.43 20.95,10.92 | 20.95,10.92 v20.95,8.1 | 20.95,10.92 JP9.4
POT0
  Top 0.152: IC1.27 13.2,33 12.18,34.02 JP7.4
POT1
  Top 0.152: IC1.26 13.7,31.86 13.57,31.99 13.57,33.26 13.18,33.66 JP7.3
RC0-IN  (via drill 0.33)
  Top 0.152: JP2.2 2.7,28.89 5.08,28.89 6.35,27.62 v6.67,27.62
  Bottom 0.152: IC7.2 9.21,34.45 8.89,34.13 7.3,34.13 6.98,33.81 6.98,31.59 6.19,30.8 6.19,28.1 v6.67,27.62
RC0/RX3  (via drill 0.33)
  Top 0.152: v7.3,26.99 7.64,26.65 IC1.38 9.51,26.65 9.68,26.83 9.68,27.78 11.7,29.79 IC1.30
  Bottom 0.152: v7.3,26.99 7.3,27.86 6.51,28.65 6.51,30.64 7.3,31.43 7.3,33.21 IC7.4 7.78,33.53
RC1/TX3
  Top 0.152: JP2.3 2.7,26.35 6.59,26.35 7.29,25.65 IC1.40 9.62,25.65 10,26.04 10,27.62 12.2,29.82 IC1.29
RC2
  Top 0.152: IC1.37 8.01,27.15 6.91,28.26 6.19,28.26 4.29,30.16 JP3.2
RC2-0
  Top 0.152: IC1.39 7.27,26.15 5.79,27.62 JP3.3
REGOUT
  Bottom 0.152: IC2.10 17.03,24.57 17.15,24.45 C18.1
RX1  (via drill 0.33)
  Top 0.152: IC1.43 7.96,24.15 7.62,23.81 7.62,22.38 7.46,22.23 v7.46,21.75 7.46,21.11 8.25,20.32 D6.A D5.A
  Bottom 0.152: R16.1 7.79,21.75 v7.46,21.75
RX2
  Top 0.152: IC1.17 18.2,30.38 18.89,29.69 20.48,29.69 20.95,30.16 20.95,33.34 20.16,34.13 20.16,34.92 19.76,35.32 19.76,37.31 JP12.2
RX5  (via drill 0.33)
  Top 0.152: IC1.54 13.2,21.09 v13.18,21.11 | JP5.2 2.7,18.73 4.76,18.73 5.08,19.05 6.98,19.05 7.14,19.21 7.14,20.32 v6.19,21.27
  Bottom 0.152: v13.18,21.11 12.54,20.48 11.91,20.48 11.59,20.8 10.48,20.8 8.89,22.38 7.14,22.38 6.19,21.43 v6.19,21.27
SCK3  (via drill 0.33)
  Top 0.152: IC1.55 13.7,20.68 13.89,20.88 13.89,23.1 12.06,24.92 v11.35,24.92
  Bottom 0.152: IC2.23 11.79,25.36 v11.35,24.92
SWCLK
  Top 0.152: JP1.2 7.46,6.83 7.46,7.62 7.78,7.94 10,7.94 10.64,8.57 10.64,11.75 11.11,12.22 13.89,12.22 14.6,12.94 14.6,16.03 13.97,16.67 12.22,16.67 10.7,18.2 IC1.49
SWDIO
  Top 0.152: JP1.4 7.3,8.57 7.62,8.26 9.84,8.26 10.32,8.73 10.32,11.91 10.95,12.54 13.73,12.54 14.29,13.1 14.29,15.88 13.81,16.35 12.06,16.35 10.24,18.18 10.24,21.43 11.43,22.62 11.43,23.1 11.03,23.5 10.56,23.5 9.71,22.65 IC1.46
TX1
  Top 0.152: IC1.42 7.82,24.65 7.3,24.13 7.3,22.7 7.06,22.46 | IC5.17 6.23,15.67 6.03,15.88 6.03,16.67 7.14,17.78 7.14,18.73 7.46,19.05 7.46,20.56 6.83,21.19 6.83,22.23 7.06,22.46 | JP4.3 5.4,22.54 5.87,23.02 6.51,23.02 7.06,22.46
TX2  (via drill 0.33)
  Top 0.152: IC1.16 20.9,29.15 21.27,29.53 21.27,33.97 v20.8,34.45
  Bottom 0.152: v20.8,34.45 20.64,34.45 19.76,35.32 19.76,37.31 JP12.3
TX5  (via drill 0.33)
  Top 0.152: IC1.53 12.7,20.64 v12.22,21.11 | JP5.3 2.7,21.27 5.08,21.27 v6.19,22.38
  Bottom 0.152: v12.22,21.11 10.64,21.11 9.05,22.7 6.98,22.7 6.67,22.38 v6.19,22.38
VCC  (via drill 0.33, 0.4)
  Top 0.152: v10.16,6.03 10,6.03 10,6.19 9.05,6.19 9.11,6.27 R5.2
  Top 0.61: C1.+ 12.15,5.49 | 15.72,7.06 14.92,7.06 13.89,6.03 11.59,6.03 13.41,5.79 | 15.72,7.06 16.51,7.06 v18.02,5.56 | D1.C 15.72,7.06
  Top 0.762: v10.16,6.75 v10.16,6.03 11.59,6.03 12.15,5.49
  Bottom 0.152: 19.69,16.35 21.59,18.26 R8.1
  Bottom 0.203: 19.69,16.35 19.69,13.97 JP9.1 | 20.84,13.93 20.86,13.91
  Bottom 0.61: C2.1 9.05,7.46 10.16,6.35 11.11,5.4 IC3.5 | v18.02,5.56 19.61,7.14 21.27,7.14 21.83,7.7 21.83,12.94 20.86,13.91 | JP9.1 20.84,13.93
  Bottom 0.66: v10.16,6.75 10.16,6.35 v10.16,6.03
VUSB  (via drill 0.4)
  Top 0.203: IC5.8 9.8,14.61 | v6.35,10.48 6.83,10.95 8.1,10.95 8.39,11.25 C15.1 9.13,11.83 10.64,13.34 12.06,13.34 12.38,13.65 12.38,14.29 12.06,14.61 | 12.06,14.61 9.8,14.61 | 9.8,14.61 IC5.7 | C14.1 12.72,15.26 12.06,14.61
  Top 0.406: USB.VBUS 5.76,12.02 6.35,11.43 v6.35,10.48
  Bottom 0.406: v6.35,10.48 6.35,10.32 4.29,8.26 D3.A
XOR  (via drill 0.33)
  Top 0.152: IC1.41 6.92,25.15 v6.67,25.4
  Bottom 0.152: 9.68,35.4 10.02,35.4 IC7.1 | R14.2 8.75,36.34 9.68,35.4 | v6.67,25.4 5.87,26.19 5.87,30.96 6.67,31.75 6.67,33.97 7.14,34.45 8.73,34.45 9.68,35.4

### Text on the board
tNames: R | G | G | 3.3V | ESP | 0 | 1 | B | POT | GND | GND | RC0 | RC2 | CL | RC1 | R20 | CH | 3.3V | 5V | C5V | T1 | T | R1 | R | GND | G | R | v3.3 | 5V | T | m | GND | Rx | Tx | SWD | 5V | + | -
bNames: 5V | A1 | A0 | GND | GND | AUX | RC | 3.3V | 5V | UART | Tx | BL | Rx | v3.3m | GND | by / www.OlliW.eu | BAT | GND | 5V | Rx | Tx | SWD | GND | + | -